# EAGLE schematic kb2040_pocketOperator_out_revA (EAGLE 9.6.2)
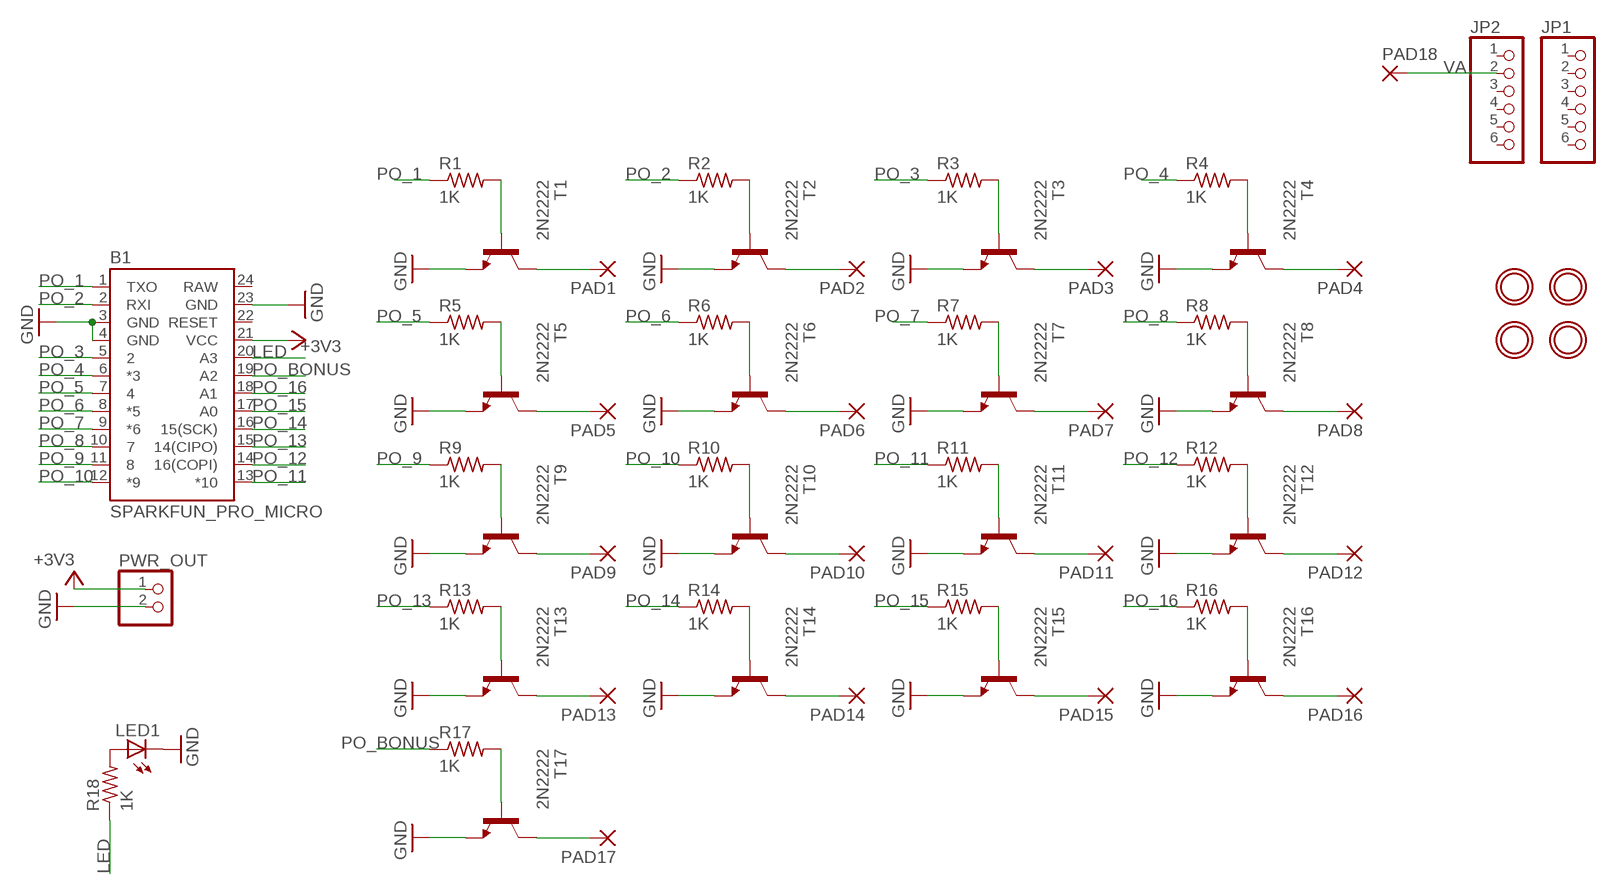
[diagram p0: schematic, sheet 1]

## Parts
B1  SPARKFUN_PRO_MICRO  [SPARKFUN_PRO_MICRO]
JP1  HEADER-1X670MIL  [1X06_ROUND_70]
JP2  HEADER-1X670MIL  [1X06_ROUND_70]
LED1  LED5MM  [LED5MM]
PAD1  2,54/1,1  [2,54/1,1]
PAD2  2,54/1,1  [2,54/1,1]
PAD3  2,54/1,1  [2,54/1,1]
PAD4  2,54/1,1  [2,54/1,1]
PAD5  2,54/1,1  [2,54/1,1]
PAD6  2,54/1,1  [2,54/1,1]
PAD7  2,54/1,1  [2,54/1,1]
PAD8  2,54/1,1  [2,54/1,1]
PAD9  2,54/1,1  [2,54/1,1]
PAD10  2,54/1,1  [2,54/1,1]
PAD11  2,54/1,1  [2,54/1,1]
PAD12  2,54/1,1  [2,54/1,1]
PAD13  2,54/1,1  [2,54/1,1]
PAD14  2,54/1,1  [2,54/1,1]
PAD15  2,54/1,1  [2,54/1,1]
PAD16  2,54/1,1  [2,54/1,1]
PAD17  2,54/1,1  [2,54/1,1]
PAD18  2,54/1,1  [2,54/1,1]
PWR_OUT  PINHD-1X2  [1X02]
R1  1K  R-US_0414/5V  [0414V]
R2  1K  R-US_0414/5V  [0414V]
R3  1K  R-US_0414/5V  [0414V]
R4  1K  R-US_0414/5V  [0414V]
R5  1K  R-US_0414/5V  [0414V]
R6  1K  R-US_0414/5V  [0414V]
R7  1K  R-US_0414/5V  [0414V]
R8  1K  R-US_0414/5V  [0414V]
R9  1K  R-US_0414/5V  [0414V]
R10  1K  R-US_0414/5V  [0414V]
R11  1K  R-US_0414/5V  [0414V]
R12  1K  R-US_0414/5V  [0414V]
R13  1K  R-US_0414/5V  [0414V]
R14  1K  R-US_0414/5V  [0414V]
R15  1K  R-US_0414/5V  [0414V]
R16  1K  R-US_0414/5V  [0414V]
R17  1K  R-US_0414/5V  [0414V]
R18  1K  R-US_0414/5V  [0414V]
T1  2N2222  [TO92-EBC-OVAL]
T2  2N2222  [TO92-EBC-OVAL]
T3  2N2222  [TO92-EBC-OVAL]
T4  2N2222  [TO92-EBC-OVAL]
T5  2N2222  [TO92-EBC-OVAL]
T6  2N2222  [TO92-EBC-OVAL]
T7  2N2222  [TO92-EBC-OVAL]
T8  2N2222  [TO92-EBC-OVAL]
T9  2N2222  [TO92-EBC-OVAL]
T10  2N2222  [TO92-EBC-OVAL]
T11  2N2222  [TO92-EBC-OVAL]
T12  2N2222  [TO92-EBC-OVAL]
T13  2N2222  [TO92-EBC-OVAL]
T14  2N2222  [TO92-EBC-OVAL]
T15  2N2222  [TO92-EBC-OVAL]
T16  2N2222  [TO92-EBC-OVAL]
T17  2N2222  [TO92-EBC-OVAL]
U$1  MOUNTINGHOLE2.5  [MOUNTINGHOLE_2.5_PLATED]
U$17  MOUNTINGHOLE2.5  [MOUNTINGHOLE_2.5_PLATED]
U$19  MOUNTINGHOLE2.5  [MOUNTINGHOLE_2.5_PLATED]
U$21  MOUNTINGHOLE2.5  [MOUNTINGHOLE_2.5_PLATED]

## Nets
+3V3: B1.21(VCC) PWR_OUT.1
GND: B1.3(GND) B1.4(GND) B1.23(GND) LED1.K(C) PWR_OUT.2 T1.E T2.E T3.E T4.E T5.E T6.E T7.E T8.E T9.E T10.E T11.E T12.E T13.E T14.E T15.E T16.E T17.E
LED: B1.20(A3) R18.1
N$1: R2.2 T2.B
N$2: R1.2 T1.B
N$3: PAD1.1(P) T1.C
N$4: PAD2.1(P) T2.C
N$5: R3.2 T3.B
N$6: PAD3.1(P) T3.C
N$7: R4.2 T4.B
N$8: PAD4.1(P) T4.C
N$9: R5.2 T5.B
N$10: PAD5.1(P) T5.C
N$11: R6.2 T6.B
N$12: PAD6.1(P) T6.C
N$13: R7.2 T7.B
N$14: PAD7.1(P) T7.C
N$15: R8.2 T8.B
N$16: PAD8.1(P) T8.C
N$17: R9.2 T9.B
N$18: PAD9.1(P) T9.C
N$19: R10.2 T10.B
N$20: PAD10.1(P) T10.C
N$21: R11.2 T11.B
N$22: PAD11.1(P) T11.C
N$23: R12.2 T12.B
N$24: PAD12.1(P) T12.C
N$25: R13.2 T13.B
N$26: PAD13.1(P) T13.C
N$27: R14.2 T14.B
N$28: PAD14.1(P) T14.C
N$29: R15.2 T15.B
N$30: PAD15.1(P) T15.C
N$31: R16.2 T16.B
N$32: PAD16.1(P) T16.C
N$33: R17.2 T17.B
N$34: PAD17.1(P) T17.C
N$35: LED1.A R18.2
PO_1: B1.1(TXO) R1.1
PO_2: B1.2(RXI) R2.1
PO_3: B1.5 R3.1
PO_4: B1.6(*3) R4.1
PO_5: B1.7 R5.1
PO_6: B1.8(*5) R6.1
PO_7: B1.9(*6) R7.1
PO_8: B1.10 R8.1
PO_9: B1.11 R9.1
PO_10: B1.12(*9) R10.1
PO_11: B1.13(*10) R11.1
PO_12: B1.14(16(COPI)) R12.1
PO_13: B1.15(14(CIPO)) R13.1
PO_14: B1.16(15(SCK)) R14.1
PO_15: B1.17(A0) R15.1
PO_16: B1.18(A1) R16.1
PO_BONUS: B1.19(A2) R17.1
VA: JP2.2 PAD18.1(P)
Unconnected: B1.22(RESET) JP1.1 JP1.2 JP1.3 JP1.4 JP1.5 JP1.6 JP2.1 JP2.3 JP2.4 JP2.5 JP2.6

## Power pins joined to a net without a drawn wire
RAW: B1.24(RAW)

## Library data of the parts
B1 = SparkFun-Boards:SPARKFUN_PRO_MICRO: SparkFun Pro Micro Atmega32U4 compatible footprint. SparkFun Products: 3.3V/8MHz <https://www.sparkfun.com/products/12587> 5V/16MHz <https://www.sparkfun.com/products/12640>
JP1 JP2 = microbuilder:HEADER-1X6: PIN HEADER
LED1 = adafruit:LED: LED OSRAM: - CHIPLED LG R971, LG N971, LY N971, LG Q971, LY Q971, LO R971, LY R971 LH N974, LH R974 LS Q976, LO Q976, LY Q976 LO Q996 - Hyper CHIPLED LW Q18S LB Q993, LB Q99A, LB R99A - SideLED LS A670, LO A670, LY A670, LG A670, LP A670 LB A673, LV A673, LT A673, LW A673 LH A674 LY A675 LS A676, LA A676, LO A676, LY A676, LW A676 LS A679, LY A679, LG A679 - Hyper Micro SIDELED® LS Y876, LA Y876, LO Y876, LY Y876 LT Y87S - SmartLED LW L88C, LW L88S LB L89C, LB L89S, LG L890 LS L89K, LO L89K, LY L89K LS L896, LA L896, LO L896, LY L896 - TOPLED LS T670, LO T670, LY T670, LG T670, LP T670 LSG T670, LSP T670, LSY T670, LOP T670, LYG T670 LG T671, LOG T671, LSG T671 LB T673, LV T673, LT T673, LW T673 LH T674 LS T676, LA T676, LO T676, LY T676, LB T676, LH T676, LSB T676, LW T676 LB T67C, LV T67C, LT T67C, LS T67K, LO T67K, LY T67K, LW E67C LS E67B, LA E67B, LO E67B, LY E67B, LB E67C, LV E67C, LT E67C LW T67C LS T679, LY T679, LG T679 LS T770, LO T770, LY T770, LG T770, LP T770 LB T773, LV T773, LT T773, LW T773 LH T774 LS E675, LA E675, LY E675, LS T675 LS T776, LA T776, LO T776, LY T776, LB T776 LHGB T686 LT T68C, LB T68C - Hyper Mini TOPLED® LB M676 - Mini TOPLED Santana® LG M470 LS M47K, LO M47K, LY M47K Source: http://www.osram.convergy.de/
PAD1-PAD18 = wirepad:2,54/1,1: THROUGH-HOLE PAD
PWR_OUT = pinhead:PINHD-1X2: PIN HEADER
R1-R18 = adafruit:R-US_: RESISTOR, American symbol
T1-T17 = adafruit:2N2222: NPN TRANSISTOR Big oval pads
U$1 U$17 U$19 U$21 = adafruit_electromech:MOUNTINGHOLE: Mounting Hole For #2 screws (0.086"/2.18mm width, 0.094"/2.4mm hole) use 2.5mm; BOM: EXCLUDE

## Net classes
2 lowpower: width 0.305 mm, drill 0.483 mm